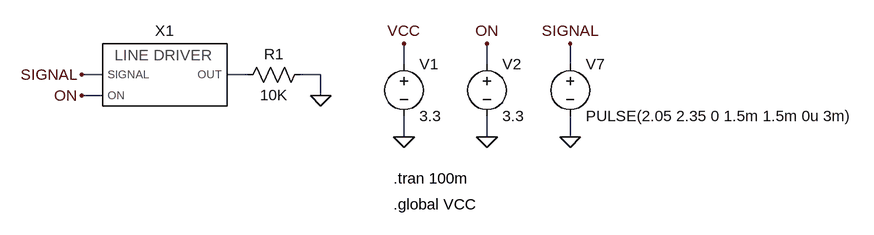
[diagram p0: schematic test_line_driver.asc]
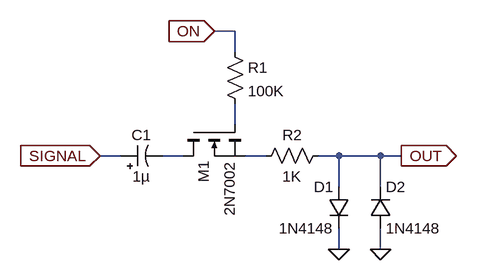
[diagram p1: sub-circuit line_driver.asc]
test_line_driver.asc, the LTspice schematic file:
Version 4
SHEET 1 1908 736
WIRE 640 320 640 288
WIRE 768 320 768 288
WIRE 896 320 896 288
WIRE 176 336 144 336
WIRE 400 336 368 336
WIRE 512 336 480 336
WIRE 176 368 144 368
WIRE 512 368 512 336
WIRE 640 432 640 400
WIRE 768 432 768 400
WIRE 896 432 896 400
FLAG 640 432 0
FLAG 640 288 VCC
FLAG 896 432 0
FLAG 896 288 SIGNAL
FLAG 512 368 0
FLAG 144 368 ON
FLAG 144 336 SIGNAL
FLAG 768 432 0
FLAG 768 288 ON
SYMBOL voltage 640 304 R0
WINDOW 123 0 0 Left 0
WINDOW 39 0 0 Left 0
SYMATTR InstName V1
SYMATTR Value 3.3
SYMBOL voltage 896 304 R0
WINDOW 123 0 0 Left 0
WINDOW 39 0 0 Left 0
SYMATTR InstName V7
SYMATTR Value PULSE(2.05 2.35 0 1.5m 1.5m 0u 3m)
SYMBOL line_driver 272 304 R0
SYMATTR InstName X1
SYMBOL res 496 320 R90
WINDOW 0 0 56 VBottom 2
WINDOW 3 32 56 VTop 2
SYMATTR InstName R1
SYMATTR Value 10K
SYMBOL voltage 768 304 R0
WINDOW 123 0 0 Left 0
WINDOW 39 0 0 Left 0
SYMATTR InstName V2
SYMATTR Value 3.3
TEXT 624 496 Left 2 !.tran 100m
TEXT 624 536 Left 2 !.global VCC

line_driver.asc, the sub-circuit schematic file:
Version 4
SHEET 1 880 680
WIRE -16 -80 -48 -80
WIRE -16 -48 -16 -80
WIRE -16 64 -16 32
WIRE -192 112 -224 112
WIRE -96 112 -128 112
WIRE 32 112 0 112
WIRE 144 112 112 112
WIRE 208 112 144 112
WIRE 240 112 208 112
WIRE 144 160 144 112
WIRE 208 160 208 112
WIRE 144 256 144 224
WIRE 208 256 208 224
FLAG 144 256 0
FLAG 208 256 0
FLAG 240 112 OUT
IOPIN 240 112 Out
FLAG -224 112 SIGNAL
IOPIN -224 112 In
FLAG -48 -80 ON
IOPIN -48 -80 In
SYMBOL res 128 96 R90
WINDOW 0 0 56 VBottom 2
WINDOW 3 32 56 VTop 2
SYMATTR InstName R2
SYMATTR Value 1K
SYMBOL diode 160 160 M0
SYMATTR InstName D1
SYMATTR Value 1N4148
SYMBOL diode 192 224 M180
WINDOW 0 24 64 Left 2
WINDOW 3 24 0 Left 2
SYMATTR InstName D2
SYMATTR Value 1N4148
SYMBOL polcap -192 128 R270
WINDOW 0 32 32 VTop 2
WINDOW 3 0 32 VBottom 2
SYMATTR InstName C1
SYMATTR Value 1µ
SYMBOL res -32 -64 R0
SYMATTR InstName R1
SYMATTR Value 100K
SYMBOL nmos -96 64 M90
SYMATTR InstName M1
SYMATTR Value 2N7002

The netlist it stands for:
* test_line_driver.asc
V1 VCC 0 3.3
V7 SIGNAL 0 PULSE(2.05 2.35 0 1.5m 1.5m 0u 3m)
XX1 SIGNAL N001 ON line_driver
R1 0 N001 10K
V2 ON 0 3.3

* block symbol definitions
.subckt line_driver SIGNAL OUT ON
R2 OUT N003 1K
D1 OUT 0 1N4148
D2 0 OUT 1N4148
C1 SIGNAL N002 1µ
R1 ON N001 100K
M1 N002 N001 N003 N003 2N7002
.ends line_driver

.model D D
.lib standard.dio
.model NMOS NMOS
.model PMOS PMOS
.lib standard.mos
.tran 100m
.global VCC
.backanno
.end